# EAGLE schematic top_PCB_mini (EAGLE 8.1.1)
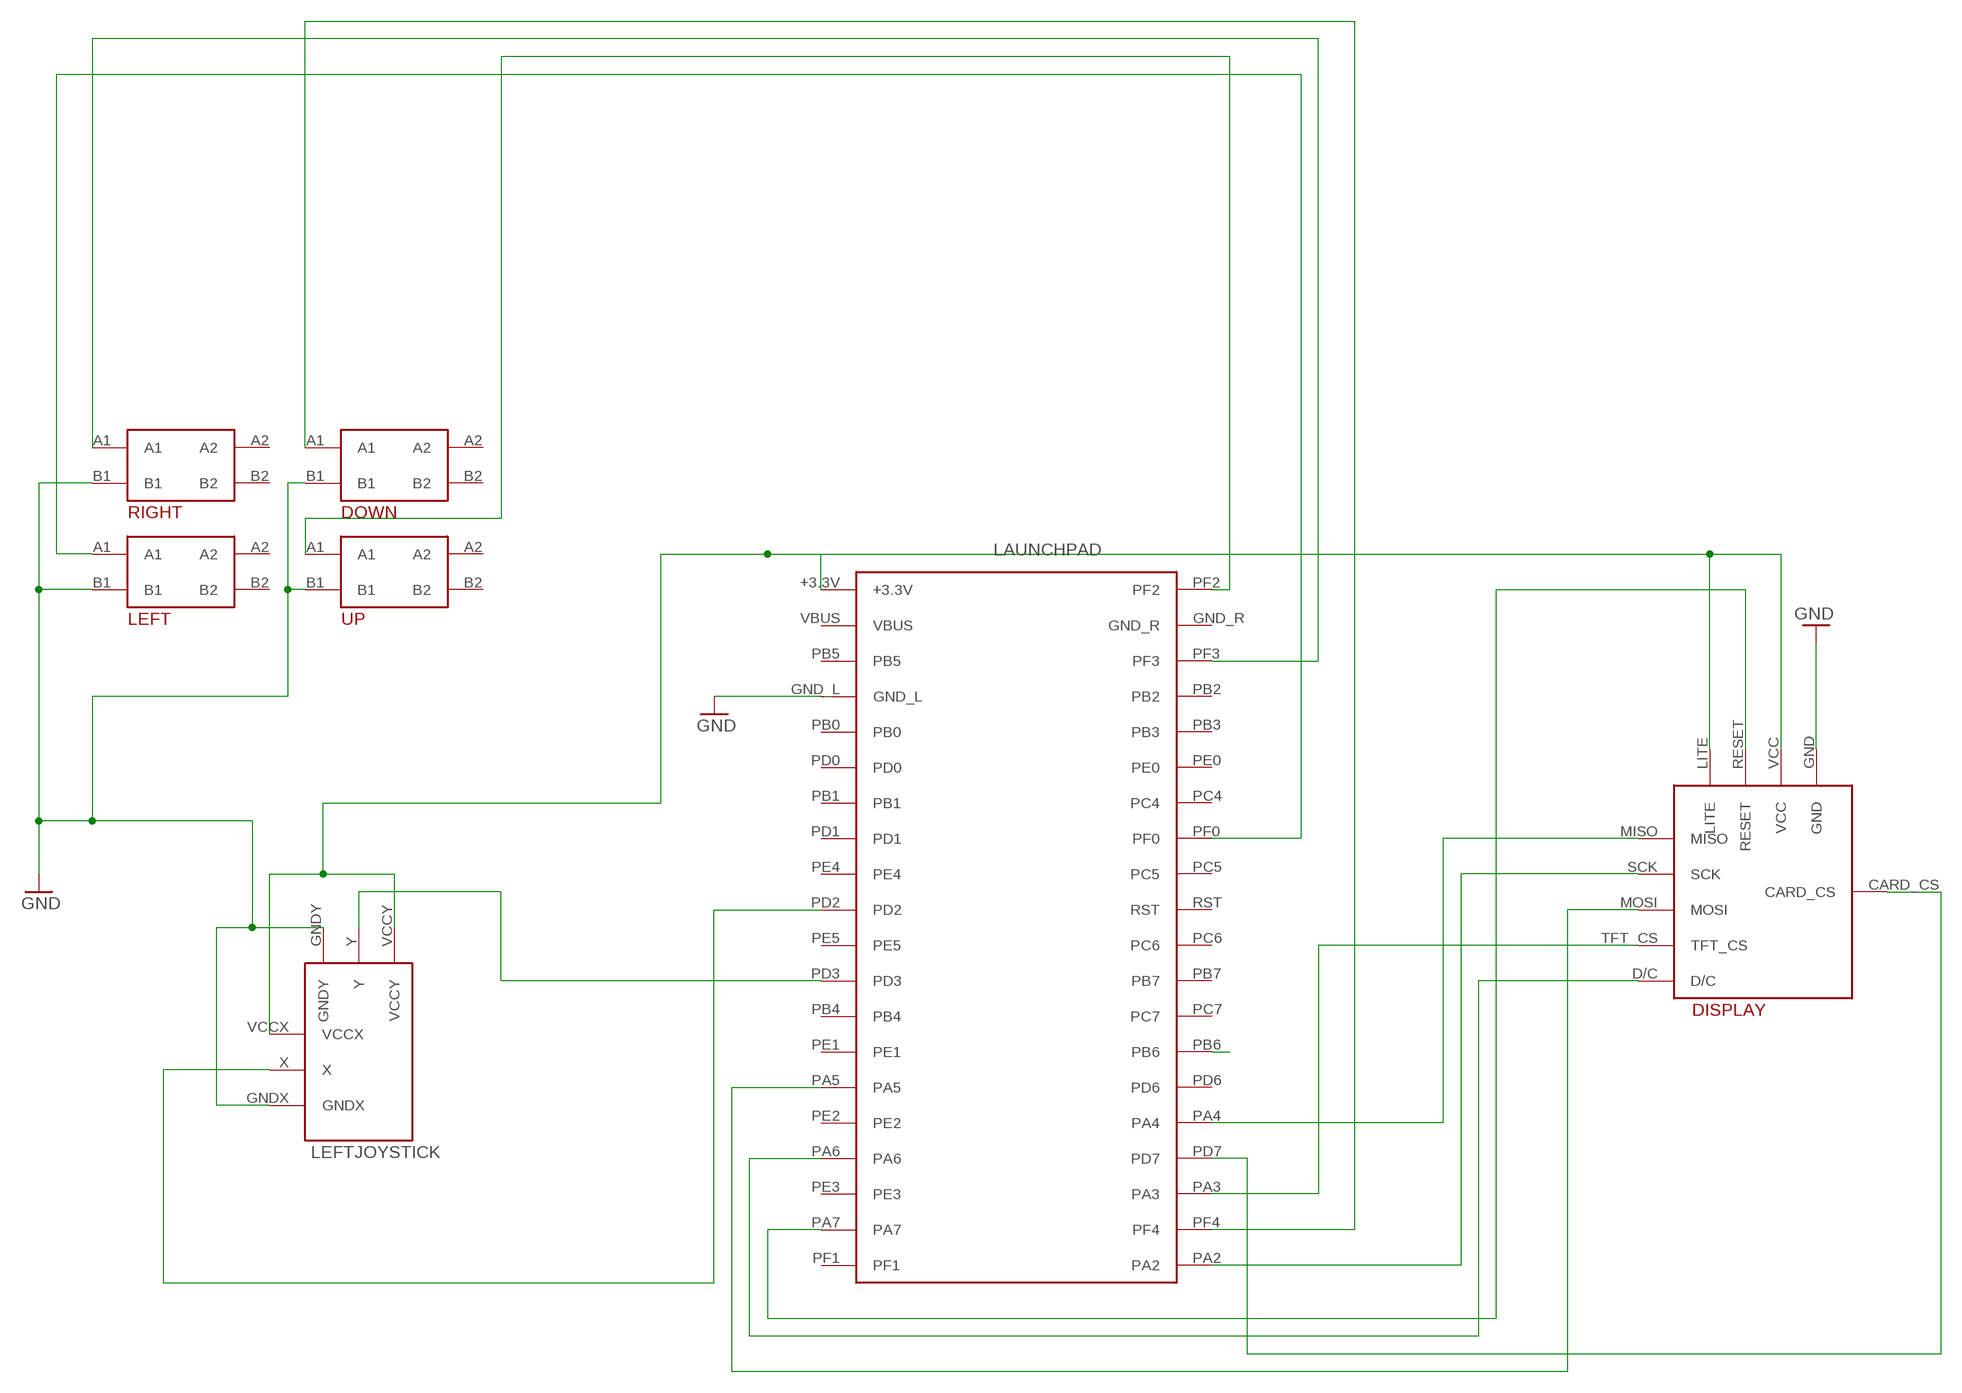
[diagram p0: schematic, sheet 1]

## Parts
DISPLAY  ADAFRUITST7735R_18  [ADAFRUITST7735R_18]
DOWN  TACTILEBUTTONTHROUGHHOLE  [B3F-40XX-MOD]
LAUNCHPAD  TM4CTM4C  [1_05X2MM]
LEFT  TACTILEBUTTONTHROUGHHOLE  [B3F-40XX-MOD]
LEFTJOYSTICK  JOYSTICKADAFRUIT  [JOYSTICK]
RIGHT  TACTILEBUTTONTHROUGHHOLE  [B3F-40XX-MOD]
UP  TACTILEBUTTONTHROUGHHOLE  [B3F-40XX-MOD]

## Nets
GND: DISPLAY.GND DOWN.B1 LAUNCHPAD.GND_L LEFT.B1 LEFTJOYSTICK.GNDX LEFTJOYSTICK.GNDY RIGHT.B1 UP.B1
N$1: DISPLAY.RESET LAUNCHPAD.PA7
N$2: DISPLAY.D/C LAUNCHPAD.PA6
N$3: DISPLAY.CARD_CS LAUNCHPAD.PD7
N$5: DISPLAY.TFT_CS LAUNCHPAD.PA3
N$6: DISPLAY.MOSI LAUNCHPAD.PA5
N$7: DISPLAY.SCK LAUNCHPAD.PA2
N$8: DISPLAY.MISO LAUNCHPAD.PA4
N$9: LAUNCHPAD.PF2 UP.A1
N$10: LAUNCHPAD.PB6
N$11: LAUNCHPAD.PD2 LEFTJOYSTICK.X
N$12: LAUNCHPAD.PD3 LEFTJOYSTICK.Y
N$29: LAUNCHPAD.PF0 LEFT.A1
N$30: LAUNCHPAD.PF3 RIGHT.A1
N$31: DISPLAY.LITE DISPLAY.VCC LAUNCHPAD.+3.3V LEFTJOYSTICK.VCCX LEFTJOYSTICK.VCCY
N$32: DOWN.A1 LAUNCHPAD.PF4
Unconnected: DOWN.A2 DOWN.B2 LAUNCHPAD.PB0 LAUNCHPAD.PB1 LAUNCHPAD.PB2 LAUNCHPAD.PB3 LAUNCHPAD.PB4 LAUNCHPAD.PB5 LAUNCHPAD.PB7 LAUNCHPAD.PC4 LAUNCHPAD.PC5 LAUNCHPAD.PC6 LAUNCHPAD.PC7 LAUNCHPAD.PD0 LAUNCHPAD.PD1 LAUNCHPAD.PD6 LAUNCHPAD.PE0 LAUNCHPAD.PE1 LAUNCHPAD.PE2 LAUNCHPAD.PE3 LAUNCHPAD.PE4 LAUNCHPAD.PE5 LAUNCHPAD.PF1 LAUNCHPAD.RST LEFT.A2 LEFT.B2 RIGHT.A2 RIGHT.B2 UP.A2 UP.B2

## Power pins joined to a net without a drawn wire
GND_R: LAUNCHPAD.GND_R
VBUS: LAUNCHPAD.VBUS

## Library data of the parts
DISPLAY = AdafruitST7735R_18:ADAFRUITST7735R_18: Device for https://www.adafruit.com/product/358
DOWN LEFT RIGHT UP = AdafruitButton:TACTILEBUTTON: Basic library for Adafruit Round Colorful Tactile Button
LAUNCHPAD = TM4C:TM4C: Tiva TM4C Lauchpad. Untested.
LEFTJOYSTICK = AdafruitJoystick:JOYSTICK: Basic version of the Adafruit 2-Axis Analog Thumbstick (PID: 2765). With credits to this (https://github.com/adafruit/Adafruit-Mini-Analog-Thumbstick-Breakout-PCB)